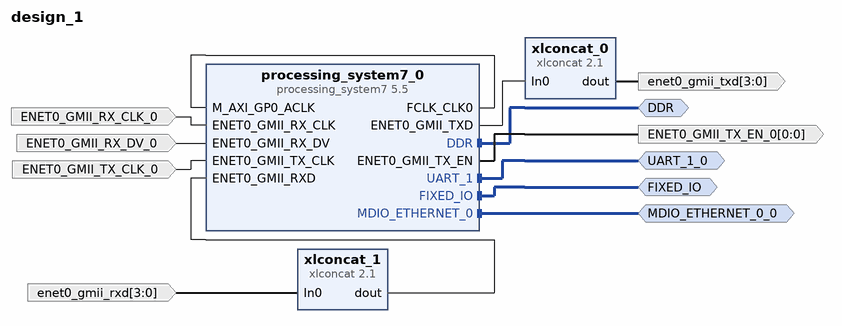
[diagram p0: block diagram of the top level]
# Vivado block design design_1, xc7z010clg400-1, Vivado 2019.2
create_bd_design design_1

create_bd_intf_port -mode Master -vlnv xilinx.com:interface:uart_rtl:1.0 UART_1_0
create_bd_intf_port -mode Master -vlnv xilinx.com:interface:ddrx_rtl:1.0 DDR
create_bd_intf_port -mode Master -vlnv xilinx.com:display_processing_system7:fixedio_rtl:1.0 FIXED_IO
create_bd_intf_port -mode Master -vlnv xilinx.com:interface:mdio_rtl:1.0 MDIO_ETHERNET_0_0
create_bd_port -dir O -from 3 -to 0 enet0_gmii_txd
create_bd_port -dir I -from 3 -to 0 enet0_gmii_rxd
create_bd_port -dir O -from 0 -to 0 ENET0_GMII_TX_EN_0
create_bd_port -dir I -type clk ENET0_GMII_RX_CLK_0
create_bd_port -dir I ENET0_GMII_RX_DV_0
create_bd_port -dir I -type clk ENET0_GMII_TX_CLK_0

create_bd_cell -type ip -vlnv xilinx.com:ip:processing_system7:5.5 processing_system7_0
set_property -dict [list \
  CONFIG.PCW_ENET0_ENET0_IO EMIO \
  CONFIG.PCW_ENET0_GRP_MDIO_ENABLE 1 \
  CONFIG.PCW_ENET0_GRP_MDIO_IO EMIO \
  CONFIG.PCW_ENET0_PERIPHERAL_ENABLE 1 \
  CONFIG.PCW_ENET0_PERIPHERAL_FREQMHZ {100 Mbps} \
  CONFIG.PCW_NAND_NAND_IO {MIO 0 2.. 14} \
  CONFIG.PCW_NAND_PERIPHERAL_ENABLE 1 \
  CONFIG.PCW_SD0_GRP_CD_ENABLE 0 \
  CONFIG.PCW_SD0_GRP_WP_ENABLE 0 \
  CONFIG.PCW_SD0_PERIPHERAL_ENABLE 1 \
  CONFIG.PCW_SD0_SD0_IO {MIO 40 .. 45} \
  CONFIG.PCW_SDIO_PERIPHERAL_FREQMHZ 100 \
  CONFIG.PCW_TTC0_PERIPHERAL_ENABLE 1 \
  CONFIG.PCW_TTC0_TTC0_IO EMIO \
  CONFIG.PCW_UART1_PERIPHERAL_ENABLE 1 \
  CONFIG.PCW_UART1_UART1_IO EMIO \
  CONFIG.PCW_UART_PERIPHERAL_FREQMHZ 100 \
  CONFIG.PCW_UIPARAM_DDR_BUS_WIDTH {16 Bit} \
  CONFIG.PCW_UIPARAM_DDR_PARTNO {MT41K128M16 JT-125} \
] [get_bd_cells processing_system7_0]
# 109 more settings of processing_system7_0 are not shown: defaults, MIO pin electricals, DDR timing, and values the tool derives
create_bd_cell -type ip -vlnv xilinx.com:ip:xlconcat:2.1 xlconcat_0
set_property -dict {CONFIG.IN0_WIDTH 4 CONFIG.NUM_PORTS 1} [get_bd_cells xlconcat_0]
create_bd_cell -type ip -vlnv xilinx.com:ip:xlconcat:2.1 xlconcat_1
set_property -dict {CONFIG.IN0_WIDTH 4 CONFIG.IN1_WIDTH 4 CONFIG.NUM_PORTS 2} [get_bd_cells xlconcat_1]

# ---- connections ----

connect_bd_intf_net [get_bd_intf_ports UART_1_0] [get_bd_intf_pins processing_system7_0/UART_1]
connect_bd_intf_net [get_bd_intf_ports DDR] [get_bd_intf_pins processing_system7_0/DDR]
connect_bd_intf_net [get_bd_intf_ports MDIO_ETHERNET_0_0] [get_bd_intf_pins processing_system7_0/MDIO_ETHERNET_0]
connect_bd_intf_net [get_bd_intf_ports FIXED_IO] [get_bd_intf_pins processing_system7_0/FIXED_IO]
connect_bd_net [get_bd_pins processing_system7_0/FCLK_CLK0] [get_bd_pins processing_system7_0/M_AXI_GP0_ACLK]
connect_bd_net [get_bd_pins processing_system7_0/ENET0_GMII_TXD] [get_bd_pins xlconcat_0/In0]
connect_bd_net [get_bd_pins xlconcat_1/dout] [get_bd_pins processing_system7_0/ENET0_GMII_RXD]
connect_bd_net [get_bd_pins xlconcat_0/dout] [get_bd_ports enet0_gmii_txd]
connect_bd_net -net In0_0_1 [get_bd_ports enet0_gmii_rxd] [get_bd_pins xlconcat_1/In0]
connect_bd_net [get_bd_pins processing_system7_0/ENET0_GMII_TX_EN] [get_bd_ports ENET0_GMII_TX_EN_0]
connect_bd_net -net ENET0_GMII_RX_CLK_0_1 [get_bd_ports ENET0_GMII_RX_CLK_0] [get_bd_pins processing_system7_0/ENET0_GMII_RX_CLK]
connect_bd_net -net ENET0_GMII_RX_DV_0_1 [get_bd_ports ENET0_GMII_RX_DV_0] [get_bd_pins processing_system7_0/ENET0_GMII_RX_DV]
connect_bd_net -net ENET0_GMII_TX_CLK_0_1 [get_bd_ports ENET0_GMII_TX_CLK_0] [get_bd_pins processing_system7_0/ENET0_GMII_TX_CLK]

validate_bd_design
save_bd_design
